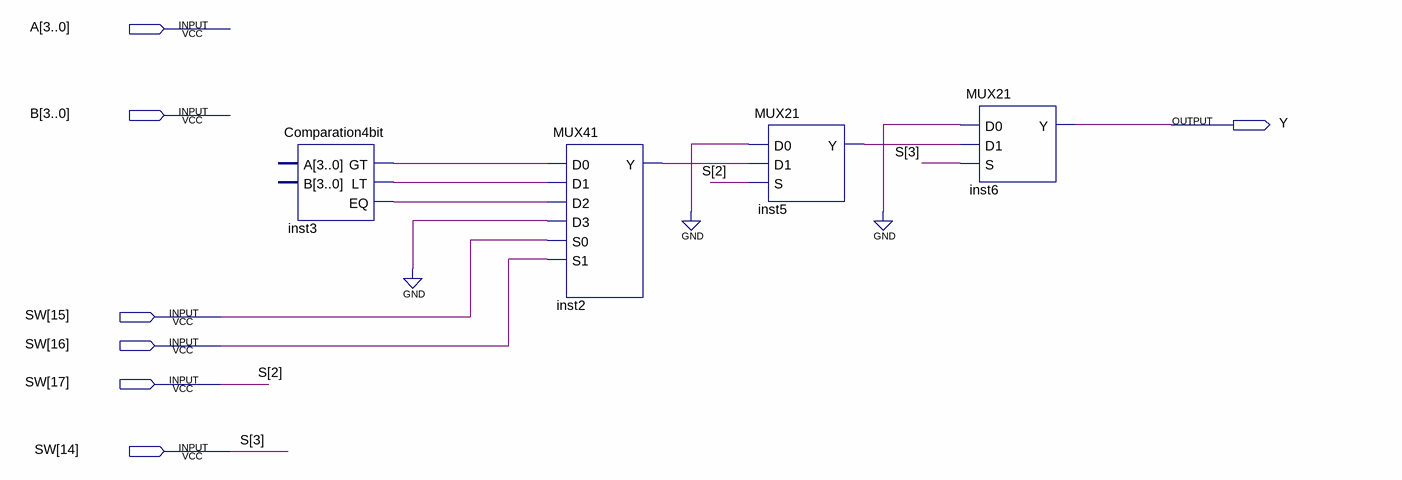
[diagram p0: schematic sheet]
// Quartus schematic Comparationfinal.bdf as structural Verilog: 4 symbols, 7 pins
module Comparationfinal (
  input  [3:0] A,
  input  [3:0] B,
  input  [17:14] SW,
  output Y
);

  wire inst2_y, inst3_eq, inst3_gt, inst3_lt, inst5_y;

  Comparation4bit inst3 (.GT(inst3_gt), .LT(inst3_lt), .EQ(inst3_eq));  // open: A, B
  MUX41 inst2 (.D0(inst3_gt), .D1(inst3_lt), .D2(inst3_eq), .D3(1'b0), .S0(SW[15]), .S1(SW[16]), .Y(inst2_y));
  MUX21 inst5 (.D0(1'b0), .D1(inst2_y), .S(SW[17]), .Y(inst5_y));
  MUX21 inst6 (.D0(1'b0), .D1(inst5_y), .S(SW[14]), .Y(Y));

  // Other names for the same wires on the sheet: S[3:2] = {SW[14], SW[17]}
endmodule
